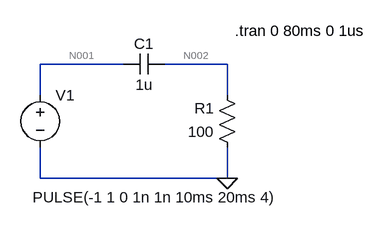
[diagram p0: schematic rc_differentiator.asc]
rc_differentiator.asc, the LTspice schematic file:
Version 4.1
SHEET 1 880 680
WIRE 32 96 -96 96
WIRE 192 96 96 96
WIRE -96 144 -96 96
WIRE 192 144 192 96
WIRE -96 272 -96 224
WIRE 192 272 192 224
WIRE 192 272 -96 272
FLAG 192 272 0
SYMBOL res 208 240 R180
WINDOW 0 36 76 Left 2
WINDOW 3 36 40 Left 2
SYMATTR InstName R1
SYMATTR Value 100
SYMBOL cap 96 80 R90
WINDOW 0 0 32 VBottom 2
WINDOW 3 32 32 VTop 2
SYMATTR InstName C1
SYMATTR Value 1u
SYMBOL voltage -96 128 R0
WINDOW 3 -12 173 Left 2
WINDOW 123 0 0 Left 0
WINDOW 39 0 0 Left 0
SYMATTR InstName V1
SYMATTR Value PULSE(-1 1 0 1n 1n 10ms 20ms 4)
TEXT 204 45 Left 2 !.tran 0 80ms 0 1us

The netlist it stands for:
* rc_differentiator.asc
R1 0 N002 100
C1 N002 N001 1u
V1 N001 0 PULSE(-1 1 0 1n 1n 10ms 20ms 4)
.tran 0 80ms 0 1us
.backanno
.end

* Results of the author's LTspice run, read from the files saved beside the schematic
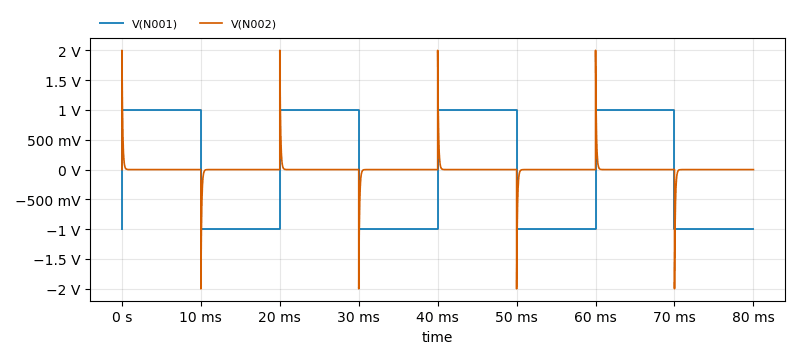
[diagram p1: Transient Analysis of rc_differentiator.asc, plotted from the saved traces]
* Transient Analysis, 1 run:
*   V(N001): min -1 V, max 1 V, average 0 V, rms 1 V, last -1 V
*   V(N002): min -2 V, max 2 V, average 762.4 nV, rms 143.8 mV, last 0 V